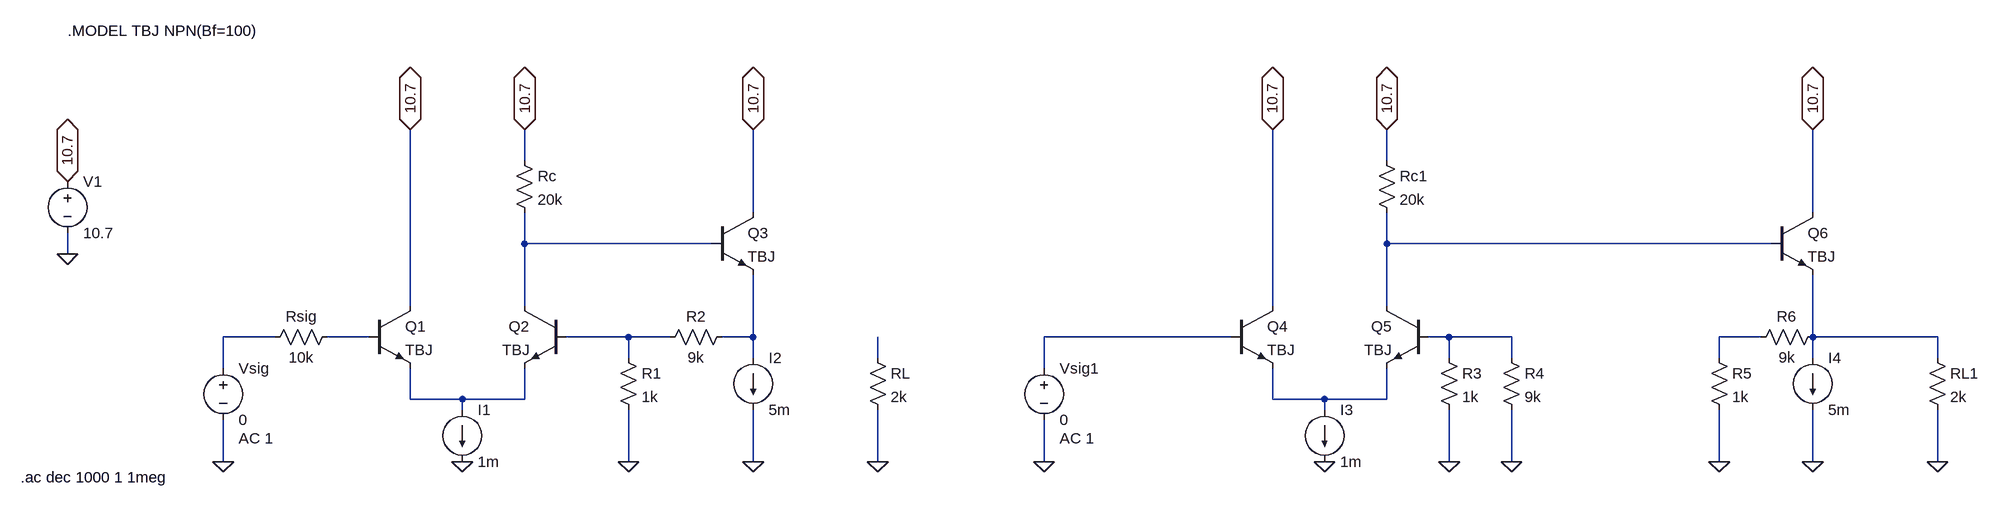
[diagram p0: schematic P2 - 2022.asc]
P2 - 2022.asc, the LTspice schematic file:
Version 4
SHEET 1 2724 680
WIRE 480 -176 480 -224
WIRE 1808 -176 1808 -224
WIRE 832 -96 832 -224
WIRE 2464 -96 2464 -224
WIRE 480 -48 480 -96
WIRE 768 -48 480 -48
WIRE 1808 -48 1808 -96
WIRE 2400 -48 1808 -48
WIRE -224 -32 -224 -64
WIRE 304 48 304 -224
WIRE 480 48 480 -48
WIRE 1632 48 1632 -224
WIRE 1808 48 1808 -48
WIRE 96 96 16 96
WIRE 240 96 176 96
WIRE 640 96 544 96
WIRE 704 96 640 96
WIRE 832 96 832 0
WIRE 832 96 784 96
WIRE 1568 96 1280 96
WIRE 1904 96 1872 96
WIRE 2000 96 1904 96
WIRE 2384 96 2320 96
WIRE 2464 96 2464 0
WIRE 2656 96 2464 96
WIRE 640 128 640 96
WIRE 832 128 832 96
WIRE 1024 128 1024 96
WIRE 1904 128 1904 96
WIRE 2000 128 2000 96
WIRE 2320 128 2320 96
WIRE 2464 128 2464 96
WIRE 2656 128 2656 96
WIRE 16 144 16 96
WIRE 1280 144 1280 96
WIRE 304 192 304 144
WIRE 384 192 304 192
WIRE 480 192 480 144
WIRE 480 192 384 192
WIRE 1632 192 1632 144
WIRE 1712 192 1632 192
WIRE 1808 192 1808 144
WIRE 1808 192 1712 192
WIRE 384 208 384 192
WIRE 1712 208 1712 192
WIRE 16 288 16 224
WIRE 640 288 640 208
WIRE 832 288 832 208
WIRE 1024 288 1024 208
WIRE 1280 288 1280 224
WIRE 1904 288 1904 208
WIRE 2000 288 2000 208
WIRE 2320 288 2320 208
WIRE 2464 288 2464 208
WIRE 2656 288 2656 208
FLAG 16 288 0
FLAG 640 288 0
FLAG 1024 288 0
FLAG 832 288 0
FLAG 384 288 0
FLAG -224 -32 0
FLAG -224 -144 10.7
IOPIN -224 -144 BiDir
FLAG 304 -224 10.7
IOPIN 304 -224 BiDir
FLAG 480 -224 10.7
IOPIN 480 -224 BiDir
FLAG 832 -224 10.7
IOPIN 832 -224 BiDir
FLAG 1280 288 0
FLAG 1904 288 0
FLAG 2656 288 0
FLAG 2464 288 0
FLAG 1712 288 0
FLAG 1632 -224 10.7
IOPIN 1632 -224 BiDir
FLAG 1808 -224 10.7
IOPIN 1808 -224 BiDir
FLAG 2464 -224 10.7
IOPIN 2464 -224 BiDir
FLAG 2320 288 0
FLAG 2000 288 0
SYMBOL voltage 16 128 R0
WINDOW 123 24 124 Left 2
WINDOW 39 0 0 Left 0
SYMATTR Value2 AC 1
SYMATTR InstName Vsig
SYMATTR Value 0
SYMBOL res 80 112 R270
WINDOW 0 32 56 VTop 2
WINDOW 3 0 56 VBottom 2
SYMATTR InstName Rsig
SYMATTR Value 10k
SYMBOL npn 240 48 R0
SYMATTR InstName Q1
SYMATTR Value TBJ
SYMBOL npn 544 48 M0
SYMATTR InstName Q2
SYMATTR Value TBJ
SYMBOL npn 768 -96 R0
SYMATTR InstName Q3
SYMATTR Value TBJ
SYMBOL res 464 -192 R0
SYMATTR InstName Rc
SYMATTR Value 20k
SYMBOL res 624 112 R0
SYMATTR InstName R1
SYMATTR Value 1k
SYMBOL res 688 112 R270
WINDOW 0 32 56 VTop 2
WINDOW 3 0 56 VBottom 2
SYMATTR InstName R2
SYMATTR Value 9k
SYMBOL res 1008 112 R0
SYMATTR InstName RL
SYMATTR Value 2k
SYMBOL current 384 208 R0
WINDOW 123 0 0 Left 0
WINDOW 39 0 0 Left 0
SYMATTR InstName I1
SYMATTR Value 1m
SYMBOL current 832 128 R0
WINDOW 123 0 0 Left 0
WINDOW 39 0 0 Left 0
SYMATTR InstName I2
SYMATTR Value 5m
SYMBOL voltage -224 -160 R0
WINDOW 123 0 0 Left 0
WINDOW 39 0 0 Left 0
SYMATTR InstName V1
SYMATTR Value 10.7
SYMBOL voltage 1280 128 R0
WINDOW 123 24 124 Left 2
WINDOW 39 0 0 Left 0
SYMATTR Value2 AC 1
SYMATTR InstName Vsig1
SYMATTR Value 0
SYMBOL npn 1568 48 R0
SYMATTR InstName Q4
SYMATTR Value TBJ
SYMBOL npn 1872 48 M0
SYMATTR InstName Q5
SYMATTR Value TBJ
SYMBOL npn 2400 -96 R0
SYMATTR InstName Q6
SYMATTR Value TBJ
SYMBOL res 1792 -192 R0
SYMATTR InstName Rc1
SYMATTR Value 20k
SYMBOL res 1888 112 R0
SYMATTR InstName R3
SYMATTR Value 1k
SYMBOL res 1984 112 R0
SYMATTR InstName R4
SYMATTR Value 9k
SYMBOL res 2640 112 R0
SYMATTR InstName RL1
SYMATTR Value 2k
SYMBOL current 1712 208 R0
WINDOW 123 0 0 Left 0
WINDOW 39 0 0 Left 0
SYMATTR InstName I3
SYMATTR Value 1m
SYMBOL current 2464 128 R0
WINDOW 123 0 0 Left 0
WINDOW 39 0 0 Left 0
SYMATTR InstName I4
SYMATTR Value 5m
SYMBOL res 2304 112 R0
SYMATTR InstName R5
SYMATTR Value 1k
SYMBOL res 2368 112 R270
WINDOW 0 32 56 VTop 2
WINDOW 3 0 56 VBottom 2
SYMATTR InstName R6
SYMATTR Value 9k
TEXT -224 -376 Left 2 !.MODEL TBJ NPN(Bf=100)
TEXT -296 312 Left 2 !.ac dec 1000 1 1meg

The netlist it stands for:
* P2 - 2022.asc
Vsig N003 0 0 AC 1
Rsig N003 N004 10k
Q1 10.7 N004 N012 0 TBJ
Q2 N001 N005 N012 0 TBJ
Q3 10.7 N001 N006 0 TBJ
Rc 10.7 N001 20k
R1 N005 0 1k
R2 N005 N006 9k
RL N011 0 2k
I1 N012 0 1m
I2 N006 0 5m
V1 10.7 0 10.7
Vsig1 N007 0 0 AC 1
Q4 10.7 N007 N013 0 TBJ
Q5 N002 N008 N013 0 TBJ
Q6 10.7 N002 N010 0 TBJ
Rc1 10.7 N002 20k
R3 N008 0 1k
R4 N008 0 9k
RL1 N010 0 2k
I3 N013 0 1m
I4 N010 0 5m
R5 N009 0 1k
R6 N009 N010 9k
.model NPN NPN
.model PNP PNP
.lib standard.bjt
.MODEL TBJ NPN(Bf=100)
.ac dec 1000 1 1meg
.backanno
.end